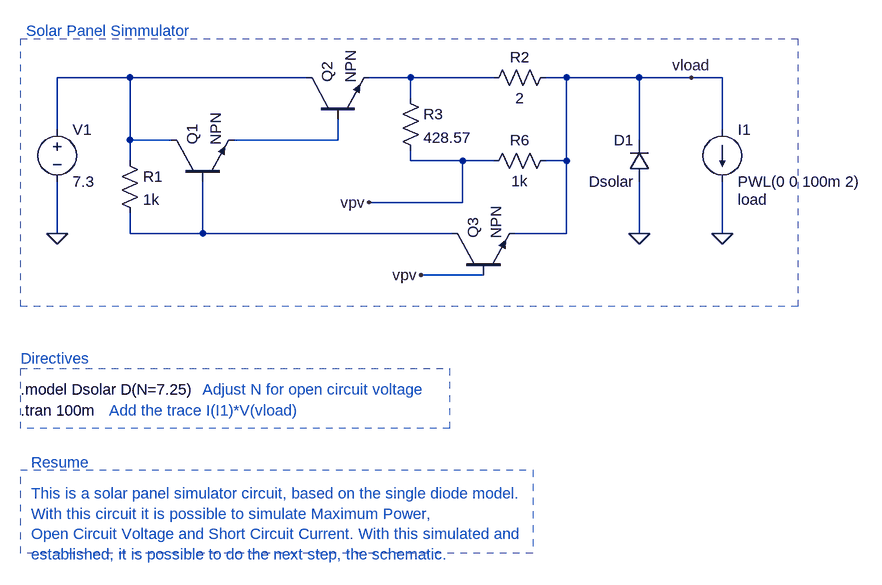
[diagram p0: schematic bjt-simulation-max-power.asc]
bjt-simulation-max-power.asc, the LTspice schematic file:
Version 4
SHEET 1 1072 1204
WIRE -592 320 -704 320
WIRE -320 320 -592 320
WIRE -160 320 -224 320
WIRE -32 320 -160 320
WIRE 80 320 48 320
WIRE 192 320 80 320
WIRE 272 320 192 320
WIRE 320 320 272 320
WIRE -160 352 -160 320
WIRE -704 400 -704 320
WIRE 320 400 320 320
WIRE -592 416 -592 320
WIRE -528 416 -592 416
WIRE -272 416 -272 384
WIRE -272 416 -432 416
WIRE 192 416 192 320
WIRE -592 448 -592 416
WIRE -160 448 -160 432
WIRE -80 448 -160 448
WIRE -32 448 -80 448
WIRE 80 448 80 320
WIRE 80 448 48 448
WIRE -80 512 -80 448
WIRE -80 512 -224 512
WIRE -704 560 -704 480
WIRE -592 560 -592 528
WIRE -480 560 -480 480
WIRE -480 560 -592 560
WIRE -96 560 -480 560
WIRE 80 560 80 448
WIRE 80 560 0 560
WIRE 192 560 192 480
WIRE 320 560 320 480
WIRE -48 624 -144 624
FLAG -704 560 0
FLAG 192 560 0
FLAG -144 624 vpv
FLAG -224 512 vpv
FLAG 272 320 vload
FLAG 320 560 0
SYMBOL npn3 -528 480 R270
SYMATTR InstName Q1
SYMBOL npn3 -320 384 R270
SYMATTR InstName Q2
SYMBOL npn3 -96 624 R270
SYMATTR InstName Q3
SYMBOL Res -48 336 R270
WINDOW 0 32 56 VTop 2
WINDOW 3 0 56 VBottom 2
SYMATTR InstName R2
SYMATTR Value 2
SYMBOL Res -608 432 R0
SYMATTR InstName R1
SYMATTR Value 1k
SYMBOL Diode 208 480 R180
WINDOW 0 24 64 Left 2
WINDOW 3 24 0 Left 2
SYMATTR InstName D1
SYMATTR Value Dsolar
SYMBOL voltage -704 384 R0
SYMATTR InstName V1
SYMATTR Value 7.3
SYMBOL Res 64 432 R90
WINDOW 0 0 56 VBottom 2
WINDOW 3 32 56 VTop 2
SYMATTR InstName R6
SYMATTR Value 1k
SYMBOL Res -176 336 R0
SYMATTR InstName R3
SYMATTR Value 428.57
SYMBOL current 320 400 R0
WINDOW 123 0 0 Left 0
WINDOW 39 24 108 Left 2
SYMATTR SpiceLine load
SYMATTR InstName I1
SYMATTR Value PWL(0 0 100m 2)
TEXT -752 248 Left 2 ;Solar Panel Simmulator
TEXT -744 960 Left 2 ;This is a solar panel simulator circuit, based on the single diode model.\nWith this circuit it is possible to simulate Maximum Power,\nOpen Circuit Voltage and Short Circuit Current. With this simulated and\nestablished, it is possible to do the next step, the schematic.
TEXT -744 912 Left 2 ;Resume
TEXT -760 800 Left 2 !.model Dsolar D(N=7.25)
TEXT -480 800 Left 2 ;Adjust N for open circuit voltage
TEXT -760 832 Left 2 !.tran 100m
TEXT -760 752 Left 2 ;Directives
TEXT -624 832 Left 2 ;Add the trace I(I1)*V(vload)
RECTANGLE Normal -760 260 436 672 2
RECTANGLE Normal -760 924 28 1052 2
RECTANGLE Normal -760 768 -100 860 3

The netlist it stands for:
* bjt-simulation-max-power.asc
Q1 N001 N004 N003 0 NPN
Q2 N001 N003 N002 0 NPN
Q3 N004 vpv vload 0 NPN
R2 N002 vload 2
R1 N001 N004 1k
D1 0 vload Dsolar
V1 N001 0 7.3
R6 vload vpv 1k
R3 N002 vpv 428.57
I1 vload 0 PWL(0 0 100m 2) load
.model D D
.lib standard.dio
.model NPN NPN
.model PNP PNP
.lib standard.bjt
* Solar Panel Simmulator
* This is a solar panel simulator circuit, based on the single diode model.
* With this circuit it is possible to simulate Maximum Power,
* Open Circuit Voltage and Short Circuit Current. With this simulated and
* established, it is possible to do the next step, the schematic.
* Resume
.model Dsolar D(N=7.25)
* Adjust N for open circuit voltage
.tran 100m
* Directives
* Add the trace I(I1)*V(vload)
.backanno
.end